# EAGLE schematic Blinkenlights (EAGLE 6.4)
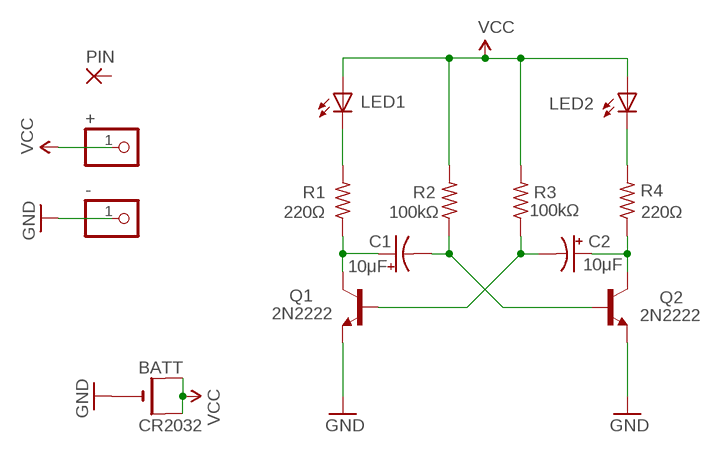
[diagram p0: schematic, sheet 1]

## Parts
+  PINHD-1X1CB  [1X01-CLEANBIG]
-  PINHD-1X1CB  [1X01-CLEANBIG]
BATT  CR2032  CR2032SMT  [CR2032-SMD]
C1  10μF  CAP-POL_E-2.54-05  [E-2.54-05]
C2  10μF  CAP-POL_E-2.54-05  [E-2.54-05]
LED1  LED5MM_BIG  [LED5MM_BIG]
LED2  LED5MM_BIG  [LED5MM_BIG]
PIN  3,17/1,3  [3,17/1,3]
Q1  2N2222  [TO92-EBC-OVAL]
Q2  2N2222  [TO92-EBC-OVAL]
R1  220Ω  RESISTOR-0207/10_BIG  [0207/10_BIG]
R2  100kΩ  RESISTOR-0207/10_BIG  [0207/10_BIG]
R3  100kΩ  RESISTOR-0207/10_BIG  [0207/10_BIG]
R4  220Ω  RESISTOR-0207/10_BIG  [0207/10_BIG]

## Nets
GND: -.1 BATT.- Q1.E Q2.E
N$1: C1.+ Q1.C R1.1
N$2: C2.+ Q2.C R4.1
N$3: C1.- Q2.B R2.1
N$4: C2.- Q1.B R3.1
N$5: LED1.K(C) R1.2
N$6: LED2.K(C) R4.2
VCC: +.1 BATT.+$1(+) BATT.+$2(+1) LED1.A LED2.A R2.2 R3.2
Unconnected: PIN.1(P)

## Library data of the parts
+ - = IXR:PINHD-1X1: Pin header 1x1 for 0.1" spacing With round pins
BATT = adafruit:CR2032
C1 C2 = IXR:CAP-POL: Polarized Capacitor
LED1 LED2 = IXR:LED: LED
PIN = wirepad:3,17/1,3: THROUGH-HOLE PAD
Q1 Q2 = IXR:2N2222: NPN TRANSISTOR Big oval pads
R1-R4 = IXR:RESISTOR: RESISTOR

## Net classes
0 default: width 0.254 mm, clearance 0.254 mm